# Altium schematic sheet Arak-Current-Control.SchDoc
size 431 x 279 mm; Date: Not shown in title block; ApprovedBy: Not shown in title block; CheckedBy: Not shown in title block; Author: Not shown in title block; CompanyName: Not shown in title block; Engineer: Not shown in title block; Organization: Not shown in title block; Address1: Not shown in title block; Address2: Not shown in title block; Address3: Not shown in title block; Address4: Not shown in title block; DocumentNumber: 6; Revision: Use project parameter SCH_Rev; SheetNumber: 6; SheetTotal: 11; PageSetup: Record=PageOptions|CenterHorizontal=True|CenterVertical=True|PrintScale=1.00|XCorrection=1.00|YCorrection=1.00|PrintKind=0|BorderSize=5000000|LeftOffset=0|BottomOffset=0|Orientation=2|PaperLength=1000|PaperWidth=1000|Scale=100|PaperSource=15|PrintQuality=600|MediaType=1|DitherType=10|PaperKind=Letter|PrintScaleMode=1; CurrentTime: Not shown in title block; CurrentDate: Not shown in title block; Time: Not shown in title block; DocumentFullPathAndName: Not shown in title block; DocumentName: Not shown in title block; ModifiedDate: Not shown in title block; ImagePath: Not shown in title block
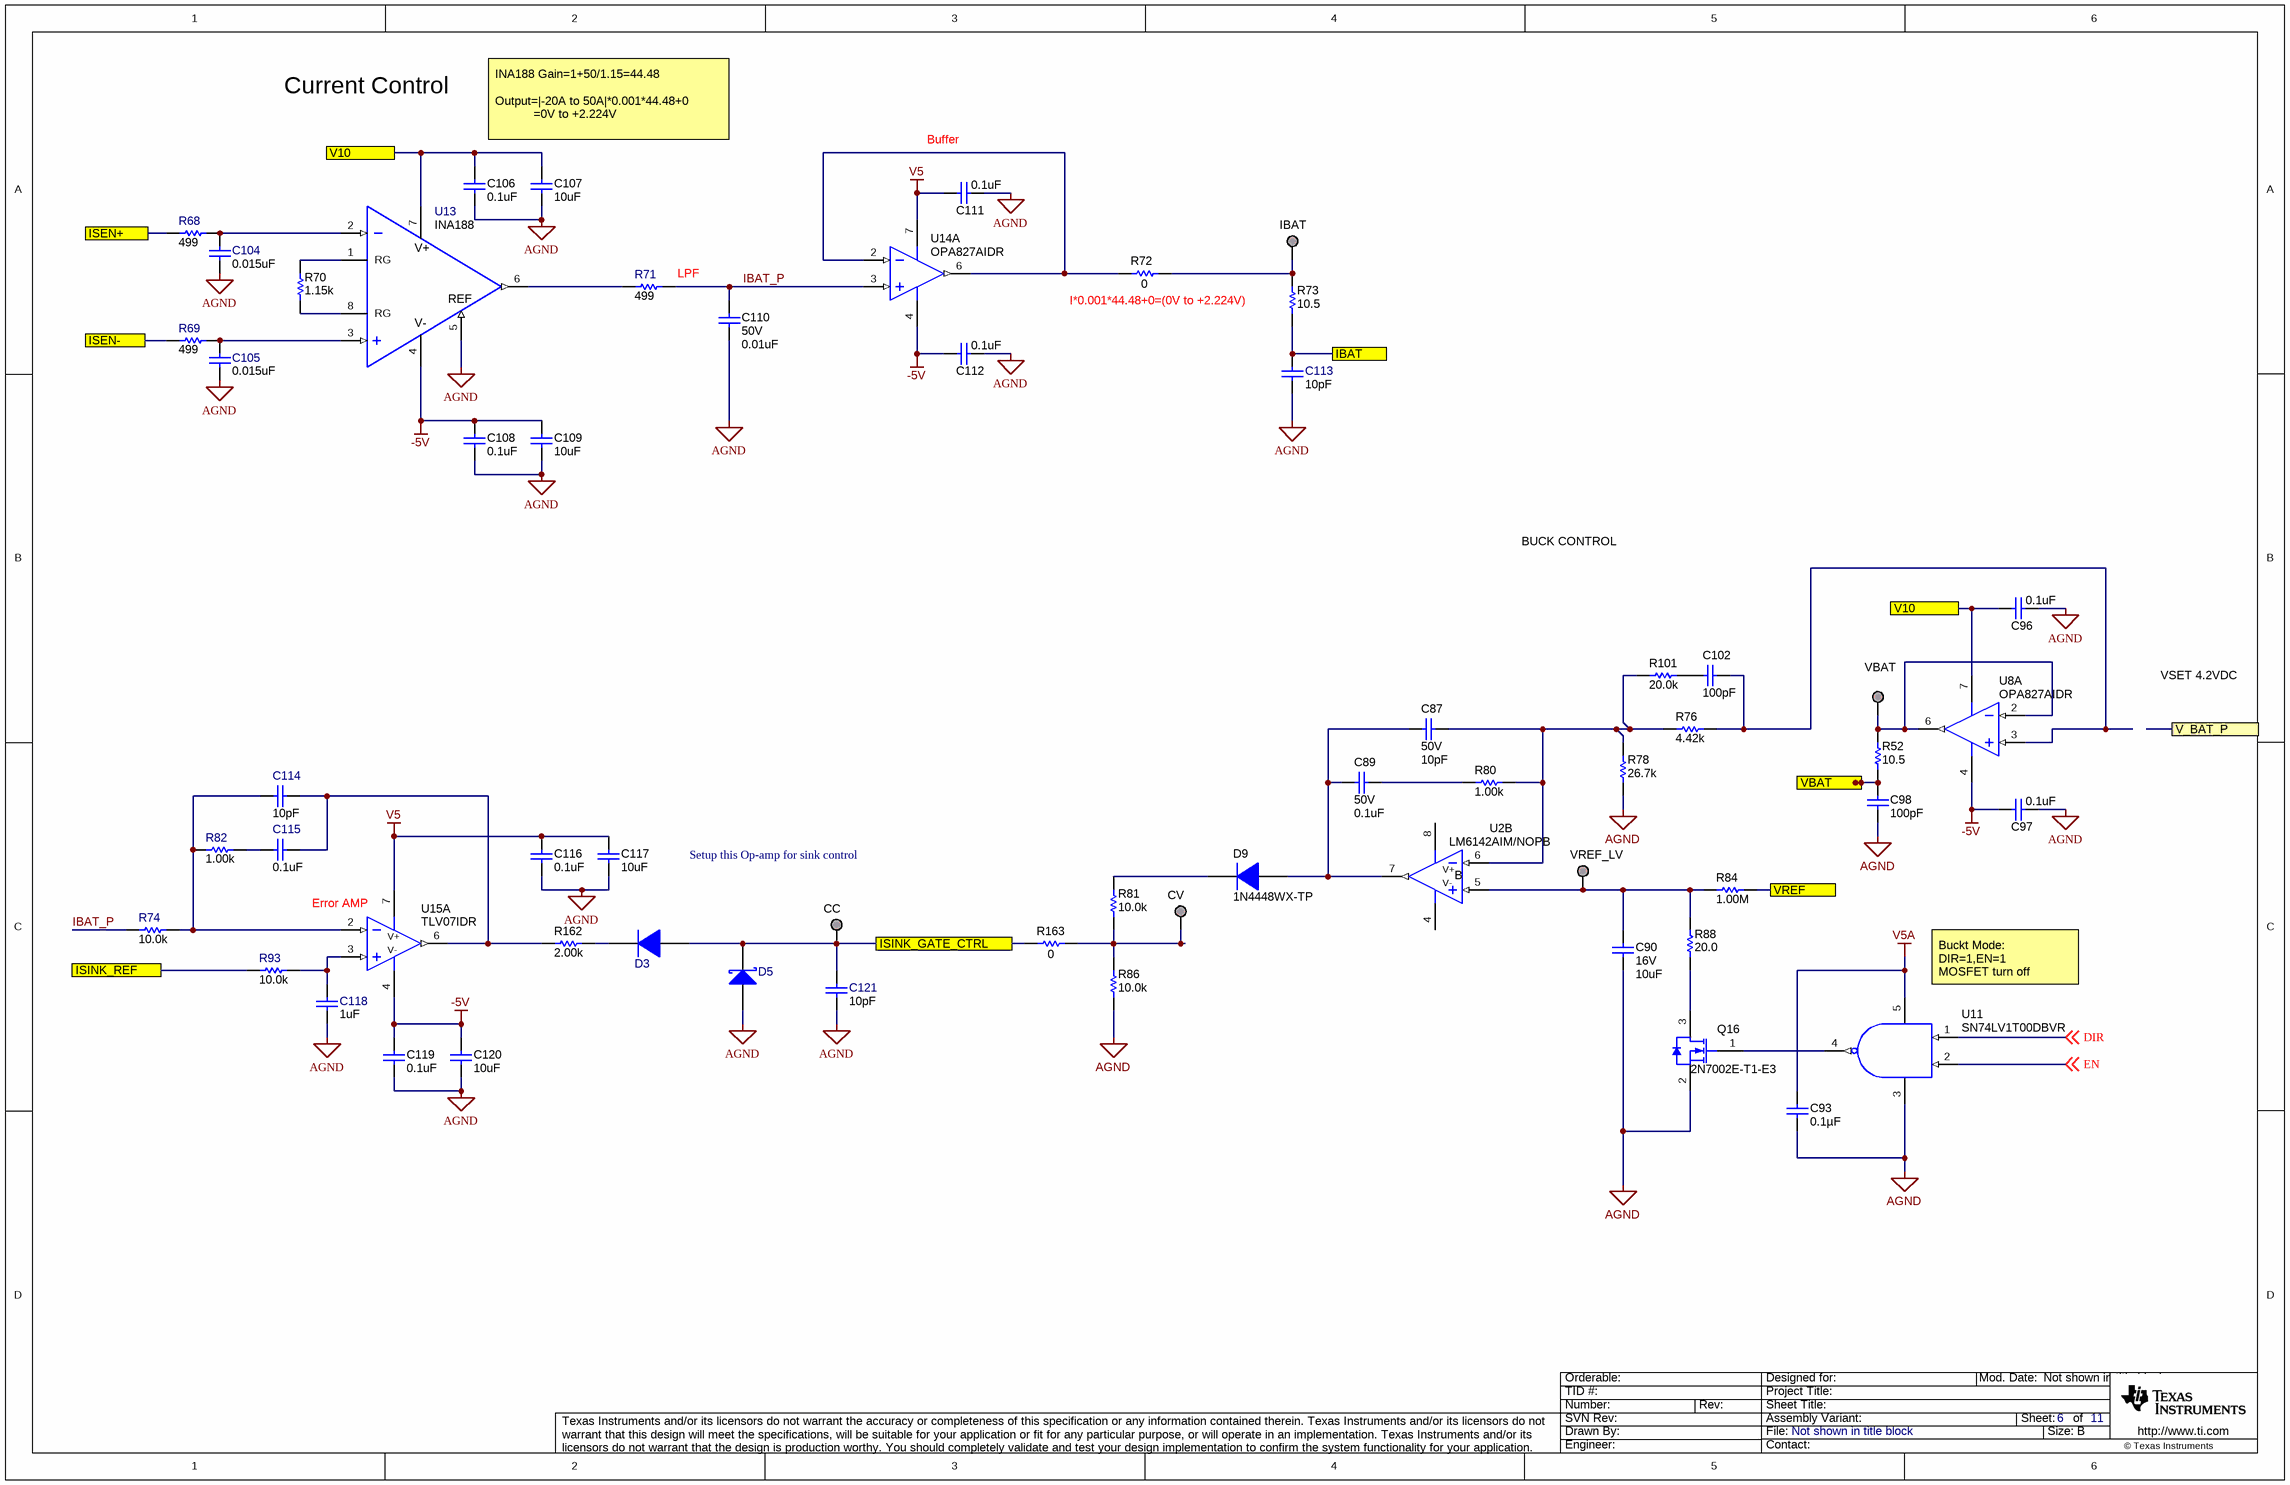
[diagram p0: Arak-Current-Control.SchDoc]

## Parts
C87  VDC_V: 50V  ValueDisplayed: 10pF  [0603]  (hidden comment: C0603C100J5GACTU)
C89  VDC_V: 50V  ValueDisplayed: 0.1uF  [0603]  (hidden comment: C1608X5R1H104K080AA)
C90  VDC_V: 16V  ValueDisplayed: 10uF  [0603]  (hidden comment: EMK107BBJ106MA-T)
C93  ValueDisplayed: 0.1µF  [0603L]  (hidden comment: GRM188R72A104KA35D)
C96  ValueDisplayed: 0.1uF  [0603]  (hidden comment: Capacitor)
C97  ValueDisplayed: 0.1uF  [0603]  (hidden comment: Capacitor)
C98  ValueDisplayed: 100pF  [0603L]  (hidden comment: Capacitor)
C102  ValueDisplayed: 100pF  [0603L]  (hidden comment: C0603C101J5GACTU)
C104  ValueDisplayed: 0.015uF  [0603]  (hidden comment: Capacitor)
C105  ValueDisplayed: 0.015uF  [0603]  (hidden comment: Capacitor)
C106  ValueDisplayed: 0.1uF  [0603]  (hidden comment: Capacitor)
C107  ValueDisplayed: 10uF  [0805_HV]  (hidden comment: Capacitor)
C108  ValueDisplayed: 0.1uF  [0603]  (hidden comment: Capacitor)
C109  ValueDisplayed: 10uF  [0805_HV]  (hidden comment: Capacitor)
C110  VDC_V: 50V  ValueDisplayed: 0.01uF  [0603]  (hidden comment: GCM188R71H103KA37D)
C111  ValueDisplayed: 0.1uF  [0603]  (hidden comment: Capacitor)
C112  ValueDisplayed: 0.1uF  [0603]  (hidden comment: Capacitor)
C113  ValueDisplayed: 10pF  [0603]  (hidden comment: Capacitor)
C114  ValueDisplayed: 10pF  [0603]  (hidden comment: Capacitor)
C115  ValueDisplayed: 0.1uF  [0603]  (hidden comment: Capacitor)
C116  ValueDisplayed: 0.1uF  [0603]  (hidden comment: Capacitor)
C117  ValueDisplayed: 10uF  [0805_HV]  (hidden comment: Capacitor)
C118  ValueDisplayed: 1uF  [0603]  (hidden comment: Capacitor)
C119  ValueDisplayed: 0.1uF  [0603]  (hidden comment: Capacitor)
C120  ValueDisplayed: 10uF  [0805_HV]  (hidden comment: Capacitor)
C121  ValueDisplayed: 10pF  [0603]  (hidden comment: Capacitor)
CC  Pogo Pad  [PogoPad]  (value not drawn)  (no BOM)
CV  Pogo Pad  [PogoPad]  (value not drawn)  (no BOM)
D3  DIODE  [SOD-523]  (value not drawn)
D5  DIODE_SCHOTTKY  [SOD-323]  (value not drawn)
D9  1N4448WX-TP  [sod-323]
IBAT  Pogo Pad  [PogoPad]  (value not drawn)  (no BOM)
Q16  2N7002E-T1-E3  [SOT-23]
R52  ValueDisplayed: 10.5  [0603]  (hidden comment: RC0603FR-0710R5L)
R68  ValueDisplayed: 499  [0603]  (hidden comment: Resistor)
R69  ValueDisplayed: 499  [0603]  (hidden comment: Resistor)
R70  1.15k  [0603]
R71  ValueDisplayed: 499  [0603]  (hidden comment: Resistor)
R72  ValueDisplayed: 0  [0603]  (hidden comment: Resistor)
R73  ValueDisplayed: 10.5  [0603]  (hidden comment: RC0603FR-0710R5L)
R74  ValueDisplayed: 10.0k  [0603]  (hidden comment: Resistor)
R76  ValueDisplayed: 4.42k  [0603L]  (hidden comment: CRCW06034K42FKEA)
R78  ValueDisplayed: 26.7k  [0603L]  (hidden comment: CRCW060326K7FKEA)
R80  ValueDisplayed: 1.00k  [0603]  (hidden comment: CRCW06031K00FKEA)
R81  ValueDisplayed: 10.0k  [0603L]  (hidden comment: CRCW060310K0FKEA)
R82  ValueDisplayed: 1.00k  [0603]  (hidden comment: Resistor)
R84  ValueDisplayed: 1.00M  [0603]  (hidden comment: MCT06030C1004FP500)
R86  ValueDisplayed: 10.0k  [0603L]  (hidden comment: CRCW060310K0FKEA)
R88  ValueDisplayed: 20.0  [0603L]  (hidden comment: CRCW060320R0FKEA)
R93  ValueDisplayed: 10.0k  [0603]  (hidden comment: Resistor)
R101  ValueDisplayed: 20.0k  [0603L]  (hidden comment: CRCW060320K0FKEA)
R162  ValueDisplayed: 2.00k  [0603]  (hidden comment: RT0603DRE072KL)
R163  ValueDisplayed: 0  [0603]  (hidden comment: Resistor)
U2  LM6142AIM/NOPB  [D0008A_N]  (part B of 2)
U8  OPA827AIDR  [D0008A_L]  (part A of 2)
U11  SN74LV1T00DBVR  [DBV0005A_N]
U13  INA188  [D0008A_N]
U14  OPA827AIDR  [D0008A_L]  (part A of 2)
U15  TLV07IDR  [D0008A_N]  (part A of 2)
VBAT  Pogo Pad  [PogoPad]  (value not drawn)  (no BOM)
VREF_LV  Pogo Pad  [PogoPad]  (value not drawn)  (no BOM)

## Ports
IBAT, ISEN+, ISEN-, ISINK_GATE_CTRL, ISINK_REF, V10, V_BAT_P, VBAT, VREF

## Nets
-5V: C97.1 C108.1 C109.1 C112.1 C119.1 C120.1 U8.4(V-) U13.4(V-) U14.4(V-) U15.4(V-)
AGND: C90.2 C93.2 C96.2 C97.2 C98.2 C104.2 C105.2 C106.2 C107.2 C108.2 C109.2 C110.2 C111.2 C112.2 C113.1 C116.2 C117.2 C118.1 C119.2 C120.2 C121.1 D5.2(A) Q16.2(S) R78.1 R86.2 U11.3(GND) U13.5(REF)
V5: C111.1 C116.1 C117.1 U14.7(V+) U15.7(V+)
V5A: C93.1 U11.5(VCC)
DIR: U11.1(A) ; off-sheet DIR
EN: U11.2(B) ; off-sheet EN
IBAT: C113.2 R73.1 ; port IBAT
IBAT_P: C110.1 R71.1 R74.1 U14.3(IN+)
ISEN+: R68.2 ; port ISEN+
ISEN-: R69.2 ; port ISEN-
ISINK_GATE_CTRL: C121.2 CC.1 D3.2(A) D5.1(K) R163.1 ; port ISINK_GATE_CTRL
ISINK_REF: R93.1 ; port ISINK_REF
V10: C96.1 C106.1 C107.1 U8.7(V+) U13.7(V+) ; port V10
VBAT: C98.1 R52.1 ; port VBAT
VREF: R84.2 ; port VREF
NetC87_1: C87.1 R76.2 R78.2 R80.2 R101.2 U2.6(IN-)
NetC87_2: C87.2 C89.2 D9.2(A) U2.7(OUT)
NetC89_1: C89.1 R80.1
NetC90_1: C90.1 R84.1 R88.2 U2.5(IN+) VREF_LV.1
NetC102_1: C102.1 R76.1 U8.3(IN+)
NetC102_2: C102.2 R101.1
NetC104_1: C104.1 R68.1 U13.2(IN-)
NetC105_1: C105.1 R69.1 U13.3(IN+)
NetC114_1: C114.1 R74.2 R82.1 U15.2(IN-)
NetC114_2: C114.2 C115.1 R162.1 U15.6(OUT)
NetC115_2: C115.2 R82.2
NetC118_2: C118.2 R93.2 U15.3(IN+)
NetCV_1: CV.1 R81.2 R86.1 R163.2
NetD3_1: D3.1(K) R162.2
NetD9_1: D9.1(K) R81.1
NetIBAT_1: IBAT.1 R72.2 R73.2
NetQ16_1: Q16.1(G) U11.4(Y)
NetQ16_3: Q16.3(D) R88.1
NetR52_2: R52.2 U8.2(IN-) U8.6(OUT) VBAT.1
NetR70_1: R70.1 U13.8(RG)
NetR70_2: R70.2 U13.1(RG)
NetR71_2: R71.2 U13.6(OUT)
NetR72_1: R72.1 U14.2(IN-) U14.6(OUT)

Not connected (* = marked no-connect by the designer): U2 4(V-) 8(V+)

## Notes on the sheet
- Current Control
- INA188 Gain=1+50/1.15=44.48
  Output=|-20A to 50A|*0.001*44.48+0
  =0V to +2.224V
- (near C111) Buffer
- (near R71) LPF
- (near R72) I*0.001*44.48+0=(0V to +2.224V)
- BUCK CONTROL
- VSET 4.2VDC
- (near U15) Error AMP
- Setup this Op-amp for sink control
- (near U11) Buckt Mode: DIR=1,EN=1
  MOSFET turn off
- Drawn By:
- SVN Rev:
- Number:
- TID #:
- Orderable:
- Rev:
- Sheet Title:
- File:
- Project Title:
- Designed for:
- Assembly Variant:
- Mod. Date:
- Sheet:
- Size:
- of
- B
- http://www.ti.com
- Texas Instruments and/or its licensors do not warrant the accuracy or completeness of this specification or any information contained therein. Texas Instruments and/or its licensors do not warrant that this design will meet the specifications, will be suitable for your application or fit for any particular purpose, or will operate in an implementation. Texas Instruments and/or its licensors do not warrant that the design is production worthy. You should completely validate and test your design implementation to confirm the system functionality for your application.
- Engineer:
- Contact:
- © Texas Instruments
- (in symbol LM6142AIM, part B) B

## Library data of the parts
C87 = CMP-0006839-4: CAP, CERM, 10 pF, 50 V, +/- 5%, C0G/NP0, 0603; Manufacturer: Kemet; TaMin_C: -55°C; Polarized: N; SizeAreaWB_mm2: 4.68; Value1: Unknown; U/M: EA; Value: 10pF; TaMax_C: 125°C; SizeZ_mm: 1; SizeX_mm: 1.6; SizeY_mm: 0.8; SizeArea_mm2: 1.28; CompType: Capacitor; AEC Category: Q200; Supplier Part Number 2: 80-C0603C100J5G; Publisher: Texas Instruments; Supplier 2: Mouser; Supplier Part Number 3: 1414601; TempCo: C0G/NP0; Supplier 3: Farnell; Published: 2008-06-19; RoHS: Y; MountType: SMT; Supplier 1: Digi-Key; PackageReference: 0603; Tolerance_%: 5%; Cap_Case: 0603; Value2: 50V; LatestRevisionDate: 2017-03-09; PartNumber: C0603C100J5GACTU; AEC Qualified: ?; Cap_F: 10pF; ComponentLink1Description: Datasheet link; Supplier Part Number 1: 399-1049-1-ND; Technology: Ceramic; ComponentLink1URL: http://www.kemet.com/kemet/web/homepage/kechome.nsf/vapubfiles/F3102_Y5V.pdf/$file/F3102_Y5V.pdf
C89 = CMP-0007010-5: CAP, CERM, 0.1 uF, 50 V, +/- 10%, X5R, 0603; Manufacturer: TDK; TaMin_C: -55°C; ESR_ohm: 0.0296; Polarized: N; SizeAreaWB_mm2: 4.68; Value1: 0.0296 ohm; U/M: EA; Value: 0.1uF; TaMax_C: 85°C; SizeZ_mm: 1; SizeX_mm: 1.6; SizeY_mm: 0.8; SizeArea_mm2: 1.28; CompType: Capacitor; Cap_F: 100nF; IRMS_A: 9.7199dA; AEC Category: Q200; Supplier Part Number 2: 810-C1608X5R1H104K080AA; Publisher: Texas Instruments; Supplier 2: Mouser; TempCo: X5R; Published: 2008-06-19; RoHS: Y; MountType: SMT; Supplier 1: Digi-Key; PackageReference: 0603; Tolerance_%: 10%; Cap_Case: 0603; Value2: 50V; LatestRevisionDate: 2017-03-09; PartNumber: C1608X5R1H104K080AA; AEC Qualified: N; ComponentLink1Description: Datasheet link; AEC Grade: N/A; Supplier Part Number 1: 445-7456-1-ND; Technology: Ceramic; ComponentLink1URL: https://product.tdk.com/en/search/capacitor/ceramic/mlcc/info?part_no=C1608X5R1H104K080AA
C90 = CMP-0007122-5: CAP, CERM, 10 uF, 16 V, +/- 20%, X5R, 0603; Manufacturer: Taiyo Yuden; TaMin_C: -55°C; Polarized: N; SizeAreaWB_mm2: 4.68; Value1: Unknown; U/M: EA; Value: 10uF; TaMax_C: 85°C; SizeZ_mm: 1; SizeX_mm: 1.6; SizeY_mm: 0.8; SizeArea_mm2: 1.28; CompType: Capacitor; Cap_F: 10µF; AEC Category: Q200; Supplier Part Number 2: 963-EMK107BBJ106MA-T; Publisher: Texas Instruments; Supplier 2: Mouser; TempCo: X5R; Published: 2008-06-19; RoHS: Y; MountType: SMT; Supplier 1: Digi-Key; PackageReference: 0603; Tolerance_%: 20%; Cap_Case: 0603; Value2: 16V; LatestRevisionDate: 2017-03-09; PartNumber: EMK107BBJ106MA-T; AEC Qualified: ?; ComponentLink1Description: Datasheet link; Supplier Part Number 1: 587-3238-1-ND; Technology: Ceramic; ComponentLink1URL: http://ds.yuden.co.jp/TYCOMPAS/ut/detail.do?productNo=EMK107BBJ106MA-T&dataUnit=M
C93 = GRM188R72A104KA35D: CAP, CERM, 0.1 µF, 100 V, +/- 10%, X7R, 0603; Manufacturer: MuRata; Polarized: N; CompType: Capacitor; Value: 0.1uF; U/M: EA; Cap_F: 0.0000001; Tolerance_%: 10; Value1: Unknown; VDC_V: 100; Value2: 100V; TaMin_C: -55; TaMax_C: 125; Cap_Case: 0603; AEC Category: Q200; SymbolVersion: 2008-07-09; PartNumber: GRM188R72A104KA35D; PackageReference: 0603; RoHS: Y; MountType: SMT; Technology: Ceramic; TempCo: X7R; Published: 2008-06-19; Publisher: Texas Instruments; LatestRevisionDate: 2015-12-07; ComponentLink1Description: Datasheet link; ComponentLink1URL: http://search.murata.co.jp/Ceramy/PnsearchViewAction.do?HnOFG=ON&HnNFG=ON&SEL_CNT=50&sLang=en&sKey=GRM188R72A104KA35D&x=9&y=9&search=startwith; Supplier 1: Digi-Key; Supplier Part Number 1: 490-3285-1-ND; Supplier 2: Mouser; Supplier Part Number 2: 81-GRM188R72A104KA35; Supplier 3: Farnell; Supplier Part Number 3: 1828921; AEC Qualified: ?
C96 C97 C106 C108 C111 C112 C116 C119 = CMP-0006752-5: CAP, CERM, 0.1 uF, 25 V, +/- 5%, X7R, 0603; PartNumber: 06033C104JAT2A; Manufacturer: AVX; Polarized: N; Value: 0.1uF; U/M: EA; Cap_F: 100nF; ESR_ohm: 0.05; Value1: 0.05 ohm; VDC_V: 25V; TaMin_C: -55°C; TaMax_C: 125°C; AEC Category: Q200; SizeArea_mm2: 1.28; SizeAreaWB_mm2: 4.68; SizeX_mm: 1.6; SizeY_mm: 0.8; SizeZ_mm: 1; CompType: Capacitor; PackageReference: 0603; RoHS: Y; Tolerance_%: 5%; Value2: 25V; MountType: SMT; Technology: Ceramic; TempCo: X7R; Cap_Case: 0603; Published: 2008-06-19; Publisher: Texas Instruments; LatestRevisionDate: 2017-03-09; ComponentLink1Description: Datasheet link; ComponentLink1URL: http://datasheets.avx.com/X7RDielectric.pdf; Supplier 1: Digi-Key; Supplier Part Number 1: 478-3713-1-ND; Supplier 2: Mouser; Supplier Part Number 2: 581-06033C104JAT2A; Supplier 3: Farnell; Supplier Part Number 3: 1740614; AEC Qualified: N; AEC Grade: N/A
C98 = CMP-0006841-4: CAP, CERM, 100 pF, 50 V, +/- 5%, C0G/NP0, 0603; PartNumber: C0603C101J5GACTU; Manufacturer: Kemet; Polarized: N; Value: 100pF; U/M: EA; Value1: Unknown; VDC_V: 50V; TaMin_C: -55°C; TaMax_C: 125°C; Cap_Case: 0603; AEC Category: Q200; SizeArea_mm2: 1.28; SizeAreaWB_mm2: 4.68; SizeX_mm: 1.6; SizeY_mm: 0.8; SizeZ_mm: 1; CompType: Capacitor; PackageReference: 0603; RoHS: Y; Cap_F: 100pF; Tolerance_%: 5%; Value2: 50V; MountType: SMT; Technology: Ceramic; TempCo: C0G/NP0; Published: 2008-06-19; Publisher: Texas Instruments; LatestRevisionDate: 2017-03-09; ComponentLink1Description: Datasheet link; ComponentLink1URL: http://www.kemet.com/kemet/web/homepage/kechome.nsf/vapubfiles/F3102_Y5V.pdf/$file/F3102_Y5V.pdf; Supplier 1: Digi-Key; Supplier Part Number 1: 399-1061-1-ND; Supplier 2: Mouser; Supplier Part Number 2: 80-C0603C101J5G; Supplier 3: Farnell; Supplier Part Number 3: 1414603; AEC Qualified: ?
C102 = C0603C101J5GACTU: CAP, CERM, 100 pF, 50 V, +/- 5%, C0G/NP0, 0603; Manufacturer: Kemet; Polarized: N; CompType: Capacitor; Value: 100pF; U/M: EA; Cap_F: 0.0000000001; Tolerance_%: 5; Value1: Unknown; VDC_V: 50; Value2: 50V; TaMin_C: -55; TaMax_C: 125; Cap_Case: 0603; SymbolVersion: 2008-07-09; PartNumber: C0603C101J5GACTU; PackageReference: 0603; RoHS: Y; MountType: SMT; Technology: Ceramic; TempCo: C0G/NP0; Published: 2008-06-19; Publisher: Texas Instruments; LatestRevisionDate: 2015-06-13; ComponentLink1Description: Datasheet link; ComponentLink1URL: http://www.kemet.com/kemet/web/homepage/kechome.nsf/vapubfiles/F3102_Y5V.pdf/$file/F3102_Y5V.pdf; Supplier 1: Digi-Key; Supplier Part Number 1: 399-1061-1-ND; Supplier 2: Mouser; Supplier Part Number 2: 80-C0603C101J5G; Supplier 3: Farnell; Supplier Part Number 3: 1414603
C104 C105 = CMP-0007383-5: CAP, CERM, 0.015 uF, 16 V, +/- 10%, X7R, 0603; PartNumber: GRM188R71C153KA01D; Manufacturer: MuRata; Polarized: N; U/M: EA; Cap_F: 15nF; Value1: Unknown; VDC_V: 16V; TaMin_C: -55°C; TaMax_C: 125°C; SizeArea_mm2: 1.28; SizeAreaWB_mm2: 4.68; SizeX_mm: 1.6; SizeY_mm: 0.8; SizeZ_mm: 1; AEC Category: Q200; CompType: Capacitor; Value: 0.015uF; PackageReference: 0603; RoHS: Y; Tolerance_%: 10%; Value2: 16V; MountType: SMT; Technology: Ceramic; TempCo: X7R; Cap_Case: 0603; Published: 2008-06-19; Publisher: Texas Instruments; LatestRevisionDate: 2017-03-09; ComponentLink1Description: Datasheet link; ComponentLink1URL: http://search.murata.co.jp/Ceramy/PnsearchViewAction.do?HnOFG=ON&HnNFG=ON&SEL_CNT=50&sLang=en&sKey=GRM188R71C153KA01D&x=9&y=9&search=startwith; Supplier 1: Mouser; Supplier Part Number 1: 81-GRM188R71C153KA; AEC Qualified: ?
C107 C109 C117 C120 = CMP-0008315-2: CAP, CERM, 10 uF, 10 V, +/- 10%, X7R, 0805; PartNumber: GRM21BR71A106KE51L; Manufacturer: MuRata; Polarized: N; Value: 10uF; U/M: EA; Cap_F: 10µF; ESR_ohm: 3m; Value1: 0.003 ohm; VDC_V: 10V; TaMin_C: -55°C; TaMax_C: 125°C; Cap_Case: 0805; AEC Category: Q200; SizeArea_mm2: 2.5; SizeAreaWB_mm2: 6.75; SizeX_mm: 2; SizeY_mm: 1.25; SizeZ_mm: 1.45; CompType: Capacitor; PackageReference: 0805; RoHS: Y; Tolerance_%: 10%; Value2: 10V; MountType: SMT; Technology: Ceramic; TempCo: X7R; Published: 2008-06-19; Publisher: Texas Instruments; LatestRevisionDate: 2017-03-09; ComponentLink1Description: Datasheet link; ComponentLink1URL: http://search.murata.co.jp/Ceramy/PnsearchViewAction.do?HnOFG=ON&HnNFG=ON&SEL_CNT=50&sLang=en&sKey=GRM21BR71A106KE51L&x=9&y=9&search=startwith; Supplier 1: Digi-Key; Supplier Part Number 1: 490-3905-1-ND; Supplier 2: Mouser; Supplier Part Number 2: 81-GRM21BR71A106KE51; Supplier 3: Farnell; Supplier Part Number 3: 1828828; AEC Qualified: ?
C110 = CMP-0007143-4: CAP, CERM, 0.01 uF, 50 V, +/- 10%, X7R, AEC-Q200 Grade 1, 0603; Manufacturer: MuRata; TaMin_C: -55°C; Polarized: N; SizeAreaWB_mm2: 4.68; Value1: Unknown; U/M: EA; Value: 0.01uF; TaMax_C: 125°C; SizeZ_mm: 1; SizeX_mm: 1.6; SizeY_mm: 0.8; SizeArea_mm2: 1.28; CompType: Capacitor; AEC Qualified: Y; Cap_F: 10nF; AEC Category: Q200; Supplier Part Number 2: 45Y5166; Publisher: Texas Instruments; Supplier 2: Newark; Supplier Part Number 3: 81-GCM188R71H103KA7D; TempCo: X7R; Supplier 3: Mouser; Published: 2008-06-19; RoHS: Y; MountType: SMT; Supplier 1: Digi-Key; PackageReference: 0603; Tolerance_%: 10%; Cap_Case: 0603; Value2: 50V; LatestRevisionDate: 2017-03-09; PartNumber: GCM188R71H103KA37D; ComponentLink1Description: Datasheet link; AEC Grade: 1; Supplier Part Number 1: 490-4778-1-ND; Technology: Ceramic; ComponentLink1URL: http://psearch.en.murata.com/capacitor/product/GCM188R71H103KA37%23.pdf
C113 C114 C121 = CMP-0007170-4: CAP, CERM, 10 pF, 50 V, +/- 5%, C0G/NP0, 0603; PartNumber: GRM1885C1H100JA01D; Manufacturer: MuRata; Polarized: N; Value: 10pF; U/M: EA; Value1: Unknown; VDC_V: 50V; TaMin_C: -55°C; TaMax_C: 125°C; SizeArea_mm2: 1.28; SizeAreaWB_mm2: 4.68; SizeX_mm: 1.6; SizeY_mm: 0.8; SizeZ_mm: 1; AEC Category: Q200; CompType: Capacitor; PackageReference: 0603; RoHS: Y; Cap_F: 10pF; Tolerance_%: 5%; Value2: 50V; MountType: SMT; Technology: Ceramic; TempCo: C0G/NP0; Cap_Case: 0603; Published: 2008-06-19; Publisher: Texas Instruments; LatestRevisionDate: 2017-03-09; ComponentLink1Description: Datasheet link; ComponentLink1URL: http://search.murata.co.jp/Ceramy/PnsearchViewAction.do?HnOFG=ON&HnNFG=ON&SEL_CNT=50&sLang=en&sKey=GRM1885C1H100JA01D&x=9&y=9&search=startwith; Supplier 1: Digi-Key; Supplier Part Number 1: 490-1403-1-ND; Supplier 2: Mouser; Supplier Part Number 2: 81-GRM39C100D50; Supplier 3: Farnell; Supplier Part Number 3: 8819815; AEC Qualified: ?
C115 = CMP-0007334-5: CAP, CERM, 0.1 uF, 16 V, +/- 10%, X5R, 0603; PartNumber: GRM188R61C104KA01D; Manufacturer: MuRata; Polarized: N; Value: 0.1uF; U/M: EA; Cap_F: 100nF; Value1: Unknown; VDC_V: 16V; TaMin_C: -55°C; TaMax_C: 85°C; SizeArea_mm2: 1.28; SizeAreaWB_mm2: 4.68; SizeX_mm: 1.6; SizeY_mm: 0.8; SizeZ_mm: 1; AEC Category: Q200; CompType: Capacitor; PackageReference: 0603; RoHS: Y; Tolerance_%: 10%; Value2: 16V; MountType: SMT; Technology: Ceramic; TempCo: X5R; Cap_Case: 0603; Published: 2008-06-19; Publisher: Texas Instruments; LatestRevisionDate: 2017-03-09; ComponentLink1Description: Datasheet link; ComponentLink1URL: http://search.murata.co.jp/Ceramy/PnsearchViewAction.do?HnOFG=ON&HnNFG=ON&SEL_CNT=50&sLang=en&sKey=GRM188R61C104KA01D&x=9&y=9&search=startwith; Supplier 1: Digi-Key; Supplier Part Number 1: GRM188R61C104KA01D-ND; Supplier 2: Mouser; Supplier Part Number 2: 81-GRM188R61C104KA1D; AEC Qualified: ?
C118 = CMP-0007302-5: CAP, CERM, 1 uF, 6.3 V, +/- 10%, X5R, 0603; PartNumber: GRM188R60J105KA01D; Manufacturer: MuRata; Polarized: N; Value: 1uF; U/M: EA; Cap_F: 1µF; Value1: Unknown; VDC_V: 6.3V; TaMin_C: -55°C; TaMax_C: 85°C; SizeArea_mm2: 1.28; SizeAreaWB_mm2: 4.68; SizeX_mm: 1.6; SizeY_mm: 0.8; SizeZ_mm: 1; AEC Category: Q200; CompType: Capacitor; PackageReference: 0603; RoHS: Y; Tolerance_%: 10%; Value2: 6.3V; MountType: SMT; Technology: Ceramic; TempCo: X5R; Cap_Case: 0603; Published: 2008-06-19; Publisher: Texas Instruments; LatestRevisionDate: 2017-03-09; ComponentLink1Description: Datasheet link; ComponentLink1URL: http://search.murata.co.jp/Ceramy/PnsearchViewAction.do?HnOFG=ON&HnNFG=ON&SEL_CNT=50&sLang=en&sKey=GRM188R60J105KA01D&x=9&y=9&search=startwith; Supplier 1: Digi-Key; Supplier Part Number 1: 490-1550-1-ND; Supplier 2: Mouser; Supplier Part Number 2: 81-GRM39R105K6.3; Supplier 3: Farnell; Supplier Part Number 3: 9527699; AEC Qualified: ?
CC CV IBAT VBAT VREF_LV = PogoPad: Pad for Pogo Pin Connector; SymbolCreator: codlsc; SymbolVersion: 2010-09-27; PackageReference: N/A; CompType: Pogo Pad; Publisher: Texas Instruments; LatestRevisionDate: 2016-12-05; LatestRevisionNote: Added Alternate PartNumber and Alternate Manufacturer parameters to appropriate components.
D3 = CMP-0076957-2: Diode, Switching, 75 V, 0.3 A, SOD-523; PartNumber: 1N4148X-TP; Manufacturer: Micro Commercial Components; U/M: EA; Vf_V: 1.25V; Value: 75V; Value1: 0.3A; Io_A: 3dA; TJmax_C: 150°C; SizeAreaWB_mm2: 5.13; SizeArea_mm2: 1.53; SizeX_mm: 1.7; SizeY_mm: 0.9; SizeZ_mm: 0.65; AEC Category: Q101; Green_Lifecycle: Not Set; Green_REACh: Incomplete; PackageReference: SOD-523; CompType: Diode; Value2: 1.25V; Vr_V: 75V; MountType: SMT; Type: Switching; RoHS: Y; Published: 2008-06-26; Publisher: Texas Instruments; LatestRevisionDate: 2017-07-25; ComponentLink1Description: Datasheet link; ComponentLink1URL: http://www.mccsemi.com/up_pdf/1N4148X(SOD-523).PDF; Supplier 1: Digi-Key; Supplier Part Number 1: 1N4148XTPMSCT-ND; Supplier 2: Newark; Supplier Part Number 2: 69R6666; Supplier 3: Mouser; Supplier Part Number 3: 833-1N4148X-TP; AEC Qualified: ?; Green_EU RoHS: Incomplete; Green_EU RoHS-2: Incomplete
D5 = CMP-0028458-1: Diode, Schottky, 30 V, 0.2 A, SOD-323; PartNumber: BAT54WS-7-F; Manufacturer: Diodes Inc.; U/M: EA; Vf_V: 7dV; Value: 30V; Value1: 0.2A; Value2: 0.7V; Io_A: 2dA; TJmax_C: 125°C; SizeAreaWB_mm2: 8.695; SizeArea_mm2: 3.645; SizeX_mm: 2.7; SizeY_mm: 1.35; SizeZ_mm: 1; AEC Category: Q101; Green_Lifecycle: Active; Green_REACh: Passed; CompType: Diode; PackageReference: SOD-323; Vr_V: 30V; MountType: SMT; Type: Schottky; RoHS: Y; Published: 2008-06-26; Publisher: Texas Instruments; LatestRevisionDate: 2017-05-08; ComponentLink1Description: Datasheet link; ComponentLink1URL: http://www.diodes.com/datasheets/ds30098.pdf; Supplier 1: Digi-Key; Supplier Part Number 1: BAT54WS-FDICT-ND; Supplier 2: Mouser; Supplier Part Number 2: 621-BAT54WS-F; Supplier 3: Farnell; Supplier Part Number 3: 1843687; AEC Qualified: ?; Green_EU RoHS: Passed; Green_EU RoHS-2: Passed
D9 = 1N4448WX-TP: Diode, Switching, 75 V, 0.25 A, SOD-323; Manufacturer: Micro Commercial Components; U/M: EA; Value: 75V; Value1: 0.25A; Io_A: 0.25; Vr_V: 75; TJmax_C: 150; AEC Category: Q101; SymbolVersion: 2008-12-08; PartNumber: 1N4448WX-TP; PackageReference: SOD-323; CompType: Diode; Value2: V; MountType: SMT; Type: Switching; RoHS: Y; Published: 2008-06-26; Publisher: Texas Instruments; LatestRevisionDate: 2016-03-04; ComponentLink1Description: Datasheet link; ComponentLink1URL: http://www.mccsemi.com/up_pdf/1N4448WX%28SOD-323%29.PDF; Supplier 1: Digi-Key; Supplier Part Number 1: 1N4448WXTPMSCT-ND; Supplier 2: Mouser; Supplier Part Number 2: 833-1N4448WX-TP; Supplier 3: Newark; Supplier Part Number 3: 69R6669; AEC Qualified: ?
Q16 = 2N7002E-T1-E3: MOSFET, N-CH, 60 V, 0.24 A, SOT-23; Manufacturer: Vishay-Siliconix; Alternate Manufacturer: None; U/M: EA; ChType: N; Value: 60V; VdsMax_V: 60; Value1: 1.8 ohm; Rdson45_ohm: 1.8; Value2: 0.4 nC; QgTyp_nC: 0.4; Vgs_V: 20; IdsMax_A: 0.24; SymbolVersion: 2008-07-28; CompType: MOSFET; PartNumber: 2N7002E-T1-E3; PackageReference: SOT-23; RoHS: Y; MountType: SMT; Published: 2008-06-19; Publisher: Texas Instruments; LatestRevisionDate: 2015-06-16; LatestRevisionNote: Added parts.; ComponentLink1Description: Datasheet link; ComponentLink1URL: http://www.vishay.com/docs/70860/70860.pdf; Supplier 1: Digi-Key; Supplier Part Number 1: 2N7002E-T1-E3CT-ND; Supplier 2: Mouser; Supplier Part Number 2: 781-2N7002E-T1-E3; Supplier 3: Farnell; Supplier Part Number 3: 1837250
R52 R73 = CMP-0022749-2: RES, 10.5, 1%, 0.1 W, 0603; Manufacturer: Yageo America; Power_W: 100mW; TempCo: 200 ppm/C; Value_Code: 10R5; U/M: EA; Value: 10.5; EIA_Code: E96; SizeX_mm: 1.6; SizeY_mm: 0.8; SizeZ_mm: 1; Value2: 0.1W; SizeArea_mm2: 1.28; CompType: Resistor; VDC_V: 150V; AEC Category: Q200; ComponentLink1URL: http://www.yageo.com/pdf/Pu-RC0603_51_PbFree_L_2.pdf; Supplier Part Number 2: 603-RC0603FR-0710R5L; Publisher: Texas Instruments; Supplier 2: Mouser; Supplier Part Number 3: 9238247; Supplier 3: Farnell; Published: 2008-06-26; RoHS: Y; Value1: 1%; MountType: SMT; Supplier 1: Digi-Key; PackageReference: 0603; Tolerance_%: 1%; Res_ohm: 10.5; LatestRevisionDate: 2017-03-09; PartNumber: RC0603FR-0710R5L; AEC Qualified: ?; ComponentLink1Description: Datasheet link; Supplier Part Number 1: 311-10.5HRCT-ND; Technology: Thick Film
R68 R69 R71 = CMP-0022446-5: RES, 499, 1%, 0.1 W, AEC-Q200 Grade 0, 0603; PartNumber: CRCW0603499RFKEA; Manufacturer: Vishay-Dale; Value: 499; Value_Code: 499R; Power_W: 100mW; Value2: 0.1W; VDC_V: 75V; TempCo: 100 ppm/C; SizeArea_mm2: 1.28; SizeX_mm: 1.6; SizeY_mm: 0.8; SizeZ_mm: 1; EIA_Code: E96; AEC Category: Q200; AEC Qualified: Y; AEC Grade: 0; CompType: Resistor; PackageReference: 0603; RoHS: E; Res_ohm: 499; Tolerance_%: 1%; Value1: 1%; MountType: SMT; Technology: Thick Film; ComponentLink1Description: Datasheet link; ComponentLink1URL: http://www.vishay.com/docs/20035/dcrcwe3.pdf; Supplier 1: Digi-Key; Supplier Part Number 1: 541-499HCT-ND; Supplier 2: Newark; Supplier Part Number 2: 52K8569; Supplier 3: Mouser; Supplier Part Number 3: 71-CRCW0603-499-E3
R70 = CMP-0023872-3: RES, 1.15 k, 0.1%, 0.1 W, 0603; Manufacturer: Yageo America; PartNumber: RT0603BRD071K15L; Power_W: 100mW; TempCo: 25 ppm/C; Value_Code: 1k15; U/M: EA; EIA_Code: E192; SizeX_mm: 1.6; SizeY_mm: 0.8; SizeZ_mm: 1; SizeArea_mm2: 1.28; CompType: Resistor; Value2: 0.1W; VDC_V: 75V; AEC Category: Q200; Publisher: Texas Instruments; Published: 2008-06-26; RoHS: Y; Value1: 0.1%; MountType: SMT; Value: 1.15k; PackageReference: 0603; Tolerance_%: 0.1%; Res_ohm: 1.15k; LatestRevisionDate: 2017-03-09; AEC Qualified: ?; ComponentLink1Description: Datasheet link; Technology: Thin Film; ValueDisplayed: 1.15k; ComponentLink1URL: http://www.yageo.com/pdf/PYu-RT_1-to-0.05_RoHS_L_3.pdf
R72 R163 = CMP-0025874-3: RES, 0, 5%, 0.1 W, 0603; PartNumber: ERJ-3GEY0R00V; Manufacturer: Panasonic; Value: 0; Value_Code: 0000; Power_W: 100mW; Value2: 0.1W; VDC_V: 50V; TempCo: 600 ppm/C; EIA_Code: E24; U/M: EA; AEC Category: Q200; SizeArea_mm2: 1.28; SizeX_mm: 1.6; SizeY_mm: 0.8; SizeZ_mm: 1; CompType: Resistor; PackageReference: 0603; RoHS: Y; Res_ohm: 0; Tolerance_%: 5%; Value1: 5%; MountType: SMT; Technology: Thick Film; Published: 2008-06-26; Publisher: Texas Instruments; LatestRevisionDate: 2017-03-09; ComponentLink1Description: Datasheet link; ComponentLink1URL: http://www.panasonic.com/industrial/components/pdf/AOA0000CE1.pdf; Supplier 1: Digi-Key; Supplier Part Number 1: P0.0GCT-ND; Supplier 2: Mouser; Supplier Part Number 2: 667-ERJ-3GEY0R00V; Supplier 3: Farnell; Supplier Part Number 3: 2059527; AEC Qualified: ?
R74 R93 = CMP-0022746-3: RES, 10.0 k, 1%, 0.1 W, 0603; PartNumber: RC0603FR-0710KL; Manufacturer: Yageo America; Value: 10.0k; Res_ohm: 10k; Value_Code: 10k0; Power_W: 100mW; Value2: 0.1W; VDC_V: 150V; TempCo: 200 ppm/C; SizeArea_mm2: 1.28; SizeX_mm: 1.6; SizeY_mm: 0.8; SizeZ_mm: 1; EIA_Code: E96; U/M: EA; AEC Category: Q200; CompType: Resistor; PackageReference: 0603; RoHS: Y; Tolerance_%: 1%; Value1: 1%; MountType: SMT; Technology: Thick Film; Published: 2008-06-26; Publisher: Texas Instruments; LatestRevisionDate: 2017-03-09; ComponentLink1Description: Datasheet link; ComponentLink1URL: http://www.yageo.com/pdf/Pu-RC0603_51_PbFree_L_2.pdf; Supplier 1: Digi-Key; Supplier Part Number 1: 311-10.0KHRCT-ND; Supplier 2: Mouser; Supplier Part Number 2: 603-RC0603FR-0710KL; Supplier 3: Farnell; Supplier Part Number 3: 9238603; AEC Qualified: ?
R76 = CRCW06034K42FKEA: RES, 4.42 k, 1%, 0.1 W, 0603; Manufacturer: Vishay-Dale; CompType: Resistor; Value: 4.42k; Res_ohm: 4420; Value_Code: 4k42; Tolerance_%: 1; Power_W: 0.1; Value2: 0.1W; VDC_V: 75; TempCo: 100 ppm/C; EIA_Code: E96; U/M: EA; AEC Category: Q200; SizeArea_mm2: 1.28; SizeX_mm: 1.6; SizeY_mm: 0.8; SymbolVersion: 2009-05-29; PartNumber: CRCW06034K42FKEA; PackageReference: 0603; RoHS: Y; Value1: 1%; MountType: SMT; Technology: Thick Film; Published: 2008-06-26; Publisher: Texas Instruments; LatestRevisionDate: 2016-06-29; ComponentLink1Description: Datasheet link; ComponentLink1URL: http://www.vishay.com/docs/20035/dcrcwe3.pdf; Supplier 1: Digi-Key; Supplier Part Number 1: 541-4.42KHCT-ND; Supplier 2: Mouser; Supplier Part Number 2: 71-CRCW0603-4.42K-E3; Supplier 3: Farnell; Supplier Part Number 3: 1553308; AEC Qualified: ?; SizeZ_mm: 1
R78 = CRCW060326K7FKEA: RES, 26.7 k, 1%, 0.1 W, 0603; Manufacturer: Vishay-Dale; CompType: Resistor; Value: 26.7k; Res_ohm: 26700; Value_Code: 26k7; Tolerance_%: 1; Power_W: 0.1; Value2: 0.1W; VDC_V: 75; TempCo: 100 ppm/C; EIA_Code: E96; U/M: EA; AEC Category: Q200; SizeArea_mm2: 1.28; SizeX_mm: 1.6; SizeY_mm: 0.8; SymbolVersion: 2009-05-29; PartNumber: CRCW060326K7FKEA; PackageReference: 0603; RoHS: Y; Value1: 1%; MountType: SMT; Technology: Thick Film; Published: 2008-06-26; Publisher: Texas Instruments; LatestRevisionDate: 2016-06-29; ComponentLink1Description: Datasheet link; ComponentLink1URL: http://www.vishay.com/docs/20035/dcrcwe3.pdf; Supplier 1: Digi-Key; Supplier Part Number 1: 541-26.7KHCT-ND; Supplier 2: Mouser; Supplier Part Number 2: 71-CRCW0603-26.7K-E3; Supplier 3: Farnell; Supplier Part Number 3: 1768183; AEC Qualified: ?; SizeZ_mm: 1
R80 = CMP-0022109-5: RES, 1.00 k, 1%, 0.1 W, AEC-Q200 Grade 0, 0603; Manufacturer: Vishay-Dale; Power_W: 100mW; TempCo: 100 ppm/C; Value_Code: 1k00; Value: 1.00k; EIA_Code: E96; Res_ohm: 1k; SizeX_mm: 1.6; SizeY_mm: 0.8; SizeZ_mm: 1; Value2: 0.1W; SizeArea_mm2: 1.28; CompType: Resistor; AEC Qualified: Y; VDC_V: 75V; AEC Category: Q200; AEC Grade: 0; Supplier Part Number 2: 52K8015; Supplier 2: Newark; Supplier Part Number 3: 71-CRCW0603-1.0K-E3; Supplier 3: Mouser; RoHS: E; Value1: 1%; MountType: SMT; Supplier 1: Digi-Key; PackageReference: 0603; Tolerance_%: 1%; PartNumber: CRCW06031K00FKEA; ComponentLink1Description: Datasheet link; Supplier Part Number 1: 541-1.00KHCT-ND; Technology: Thick Film; ComponentLink1URL: http://www.vishay.com/docs/20035/dcrcwe3.pdf
R81 R86 = CRCW060310K0FKEA: RES, 10.0 k, 1%, 0.1 W, 0603; Manufacturer: Vishay-Dale; CompType: Resistor; Value: 10.0k; Res_ohm: 10000; Value_Code: 10k0; Tolerance_%: 1; Power_W: 0.1; Value2: 0.1W; VDC_V: 75; TempCo: 100 ppm/C; EIA_Code: E96; U/M: EA; SymbolVersion: 2009-05-29; PartNumber: CRCW060310K0FKEA; PackageReference: 0603; RoHS: Y; Value1: 1%; MountType: SMT; Technology: Thick Film; Published: 2008-06-26; Publisher: Texas Instruments; LatestRevisionDate: 2015-06-13; ComponentLink1Description: Datasheet link; ComponentLink1URL: http://www.vishay.com/docs/20035/dcrcwe3.pdf; Supplier 1: Digi-Key; Supplier Part Number 1: 541-10.0KHCT-ND; Supplier 2: Mouser; Supplier Part Number 2: 71-CRCW0603-10K-E3; Supplier 3: Farnell; Supplier Part Number 3: 1469748
R82 = CMP-0022895-3: RES, 1.00 k, 1%, 0.1 W, 0603; PartNumber: RC0603FR-071KL; Manufacturer: Yageo America; Value: 1.00k; Res_ohm: 1k; Value_Code: 1k00; Power_W: 100mW; Value2: 0.1W; VDC_V: 150V; TempCo: 200 ppm/C; SizeArea_mm2: 1.28; SizeX_mm: 1.6; SizeY_mm: 0.8; SizeZ_mm: 1; EIA_Code: E96; U/M: EA; AEC Category: Q200; CompType: Resistor; PackageReference: 0603; RoHS: Y; Tolerance_%: 1%; Value1: 1%; MountType: SMT; Technology: Thick Film; Published: 2008-06-26; Publisher: Texas Instruments; LatestRevisionDate: 2017-03-09; ComponentLink1Description: Datasheet link; ComponentLink1URL: http://www.yageo.com/pdf/Pu-RC0603_51_PbFree_L_2.pdf; Supplier 1: Digi-Key; Supplier Part Number 1: 311-1.00KHRCT-ND; Supplier 2: Mouser; Supplier Part Number 2: 603-RC0603FR-071KL; Supplier 3: Farnell; Supplier Part Number 3: 9238484; AEC Qualified: ?
R84 = CMP-0022731-2: RES, 1.00 M, 1%, 0.125 W, 0603; Manufacturer: Vishay/Beyschlag; Power_W: 125mW; TempCo: 50 ppm/C; Value_Code: 1M00; U/M: EA; Value: 1.00Meg; EIA_Code: E96; Res_ohm: 1M; SizeX_mm: 1.6; SizeY_mm: 0.8; SizeZ_mm: 1; Value2: 0.125W; SizeArea_mm2: 1.28; CompType: Resistor; AEC Qualified: N; VDC_V: 75V; AEC Category: Q200; ComponentLink1URL: http://www.vishay.com/docs/28705/mcx0x0xpro.pdf; Supplier Part Number 2: 06X5971; Publisher: Texas Instruments; Supplier 2: Newark; Supplier Part Number 3: 594-MCT06030C1004FP5; Supplier 3: Mouser; Published: 2008-06-26; RoHS: Y; Value1: 1%; MountType: SMT; Supplier 1: Digi-Key; PackageReference: 0603; Tolerance_%: 1%; LatestRevisionDate: 2017-03-09; PartNumber: MCT06030C1004FP500; ComponentLink1Description: Datasheet link; AEC Grade: N/A; Supplier Part Number 1: MCT0603-1.00M-CFCT-ND; Technology: Thin Film
R88 = CRCW060320R0FKEA: RES, 20.0, 1%, 0.1 W, 0603; Manufacturer: Vishay-Dale; CompType: Resistor; Value: 20.0; Res_ohm: 20; Value_Code: 20R0; Tolerance_%: 1; Power_W: 0.1; Value2: 0.1W; VDC_V: 75; TempCo: 100 ppm/C; EIA_Code: E96; U/M: EA; SymbolVersion: 2009-05-29; PartNumber: CRCW060320R0FKEA; PackageReference: 0603; RoHS: Y; Value1: 1%; MountType: SMT; Technology: Thick Film; Published: 2008-06-26; Publisher: Texas Instruments; LatestRevisionDate: 2015-06-13; ComponentLink1Description: Datasheet link; ComponentLink1URL: http://www.vishay.com/docs/20035/dcrcwe3.pdf; Supplier 1: Digi-Key; Supplier Part Number 1: 541-20.0HCT-ND; Supplier 2: Mouser; Supplier Part Number 2: 71-CRCW0603-20-E3; Supplier 3: Farnell; Supplier Part Number 3: 1652856
R101 = CRCW060320K0FKEA: RES, 20.0 k, 1%, 0.1 W, 0603; Manufacturer: Vishay-Dale; CompType: Resistor; Value: 20.0k; Res_ohm: 20000; Value_Code: 20k0; Tolerance_%: 1; Power_W: 0.1; Value2: 0.1W; VDC_V: 75; TempCo: 100 ppm/C; EIA_Code: E96; U/M: EA; SizeArea_mm2: 1.28; SizeX_mm: 1.6; SizeY_mm: 0.8; AEC Category: Q200; SymbolVersion: 2009-05-29; PartNumber: CRCW060320K0FKEA; PackageReference: 0603; RoHS: Y; Value1: 1%; MountType: SMT; Technology: Thick Film; Published: 2008-06-26; Publisher: Texas Instruments; LatestRevisionDate: 2016-06-29; ComponentLink1Description: Datasheet link; ComponentLink1URL: http://www.vishay.com/docs/20035/dcrcwe3.pdf; Supplier 1: Digi-Key; Supplier Part Number 1: 541-20.0KHCT-ND; Supplier 2: Mouser; Supplier Part Number 2: 71-CRCW0603-20K-E3; Supplier 3: Farnell; Supplier Part Number 3: 1469774; SizeZ_mm: 1; AEC Qualified: ?
R162 = CMP-0025080-3: RES, 2.00 k, 0.5%, 0.1 W, 0603; Manufacturer: Yageo America; Power_W: 100mW; TempCo: 50 ppm/C; Value_Code: 2k00; U/M: EA; Value: 2.00k; EIA_Code: E192; Res_ohm: 2k; SizeX_mm: 1.6; SizeY_mm: 0.8; SizeZ_mm: 1; Value2: 0.1W; SizeArea_mm2: 1.28; CompType: Resistor; VDC_V: 75V; AEC Category: Q200; Publisher: Texas Instruments; Published: 2008-06-26; RoHS: Y; Value1: 0.5%; MountType: SMT; PackageReference: 0603; Tolerance_%: 0.5%; LatestRevisionDate: 2017-03-09; PartNumber: RT0603DRE072KL; AEC Qualified: ?; ComponentLink1Description: Datasheet link; Technology: Thin Film; ComponentLink1URL: http://www.yageo.com/pdf/PYu-RT_1-to-0.05_RoHS_L_3.pdf
U2 = LM6142AIM: 17MHz Rail-to-Rail Input and Output Op Amp, D0008A; Manufacturer: Texas Instruments; CompType: OpAmp IC; SymbolVersion: 2013-12-03; PartNumber: LM6142AIM/NOPB; PackageReference: D0008A; MountType: SMT; Publisher: Texas Instruments; LatestRevisionDate: 2015-02-03; Alternate Manufacturer: Texas Instruments; ComponentLink1Description: LM6142 Datasheet; ComponentLink1URL: http://www.ti.com/lit/gpn/LM6142; ComponentLink2Description: LM6142 Web Page; ComponentLink2URL: http://www.ti.com/product/LM6142; ComponentLink3Description: SOIC Package Web Page; ComponentLink3URL: http://www.ti.com/sc/docs/psheets/type/soic.html
U8 U14 = CMP-0041267-2: Low-Noise, High-Precision, JFET-Input Operational Amplifier, 8 to 36 V, -40 to 125 degC, 8-pin SOIC (D8), Green (RoHS & no Sb/Br); Manufacturer: Texas Instruments; Vmax(V): 36; GBW(Typ)(MHz): 22; Vmin(V): 8; Iq per channel(Max)(mA): 5.2; SubFamily: Audio Operational Amplifier; Number of Channels: 1; Vn at Flatband(Typ)(nV/rtHz): 4; ComponentLink1URL: http://www.ti.com/; Code_JEDEC: MS-012; PackageDescription: 8-Pin Plastic Small Outline, Body 4.9 x 3.9 mm, Pitch 1.27 mm; ComponentLink2URL: http://www.ti.com/general/docs/lit/getliterature.tsp?genericPartNumber=OPA827&fileType=pdf; ComponentLink3Description: Package Specification; Eco-Plan: Green (RoHS & no Sb/Br); ComponentLink2Description: Datasheet; ComponentLink3URL: http://www.ti.com/litv/pdf/msoi002j; PackageReference: D0008A; DatasheetVersion: SBOS376H; PartNumber: OPA827AIDR; PackageVersion: 4040047-3/M, 06/2011; Mounting Technology: Surface Mount; ComponentLink1Description: Manufacturer URL
U11 = SN74LV1T00DBVR: Single Power Supply 2-Input Positive NAND Gate CMOS Logic Level Shifter, DBV0005A; Manufacturer: Texas Instruments; SymbolCreator: a0411947; CompType: IC; U/M: EA; SymbolVersion: 2013-07-16; PartNumber: SN74LV1T00DBVR; PackageReference: DBV0005A; MountType: SMT; ComponentLink1Description: Datasheet Link; ComponentLink1URL: http://www.ti.com/lit/ds/symlink/sn74lv1t00.pdf; Publisher: Texas Instruments; LatestRevisionDate: 2015-06-16; Alternate Manufacturer: Texas Instruments
U13 = CMP-0075744-1: 36-V, Zero-Drift, Rail-to-Rail-Out Instrumentation Amplifier, D0008A (SOIC-8); PartNumber: INA188IDR; Alternate PartNumber: INA188ID; Manufacturer: Texas Instruments; SizeArea_mm2: 30.38; SizeAreaWB_mm2: 56.58; SizeX_mm: 4.9; SizeY_mm: 6.2; SizeZ_mm: 1.75; CompType: IC; U/M: EA; PackageReference: D0008A; PackageDescription: SOIC-8; MountType: SMT; ComponentLink1Description: Datasheet Link; ComponentLink1URL: http://www.ti.com/lit/ds/symlink/ina188.pdf; RoHS: Y; Publisher: Texas Instruments; LatestRevisionDate: 2017-06-09; Alternate Manufacturer: Texas Instruments
U15 = CMP-0079847-1: 36-V Precision, Rail-to-Rail Output, Operational Amplifier, D0008A (SOIC-8); Alternate Manufacturer: Texas Instruments; SizeAreaWB_mm2: 56.58; SizeZ_mm: 1.75; SizeX_mm: 4.9; SizeY_mm: 6.2; SizeArea_mm2: 30.38; CompType: IC; AEC Qualified: N; AEC Category: Q200; ComponentLink1URL: http://www.ti.com/lit/ds/symlink/tlv07.pdf; PackageDescription: SOIC-8; MountType: SMT; ComponentLink2URL: http://www.ti.com/product/tlv07; ComponentLink3Description: Online Datasheet; ComponentLink2Description: Product Folder; Manufacturer: Texas Instruments; ComponentLink3URL: http://www.ti.com/product/tlv07/datasheet; PackageReference: D0008A; PartNumber: TLV07IDR; ComponentLink1Description: Datasheet Link; RoHS: Y